# Altium schematic sheet STLink_V3E_Module.SchDoc: STLINK V3E Module
size A4; Project: STM32H7-DK; Date: Not used; ApprovedBy: Not used; CheckedBy: Not used; Author: Not used; CompanyName: STMicroelectronics; DrawnBy: Not used; Engineer: Not used; Organization: Not used; Address1: Not used; Address2: Not used; Address3: Not used; Address4: Not used; DocumentNumber: Not used; Revision: Not used; SheetNumber: 12; SheetTotal: 16; CurrentTime: Not used; CurrentDate: Not used; Time: Not used; DocumentFullPathAndName: Not used; DocumentName: Not used; ModifiedDate: Not used; ImagePath: Not used; ProjectName: Not used; Application_BuildNumber: Not used
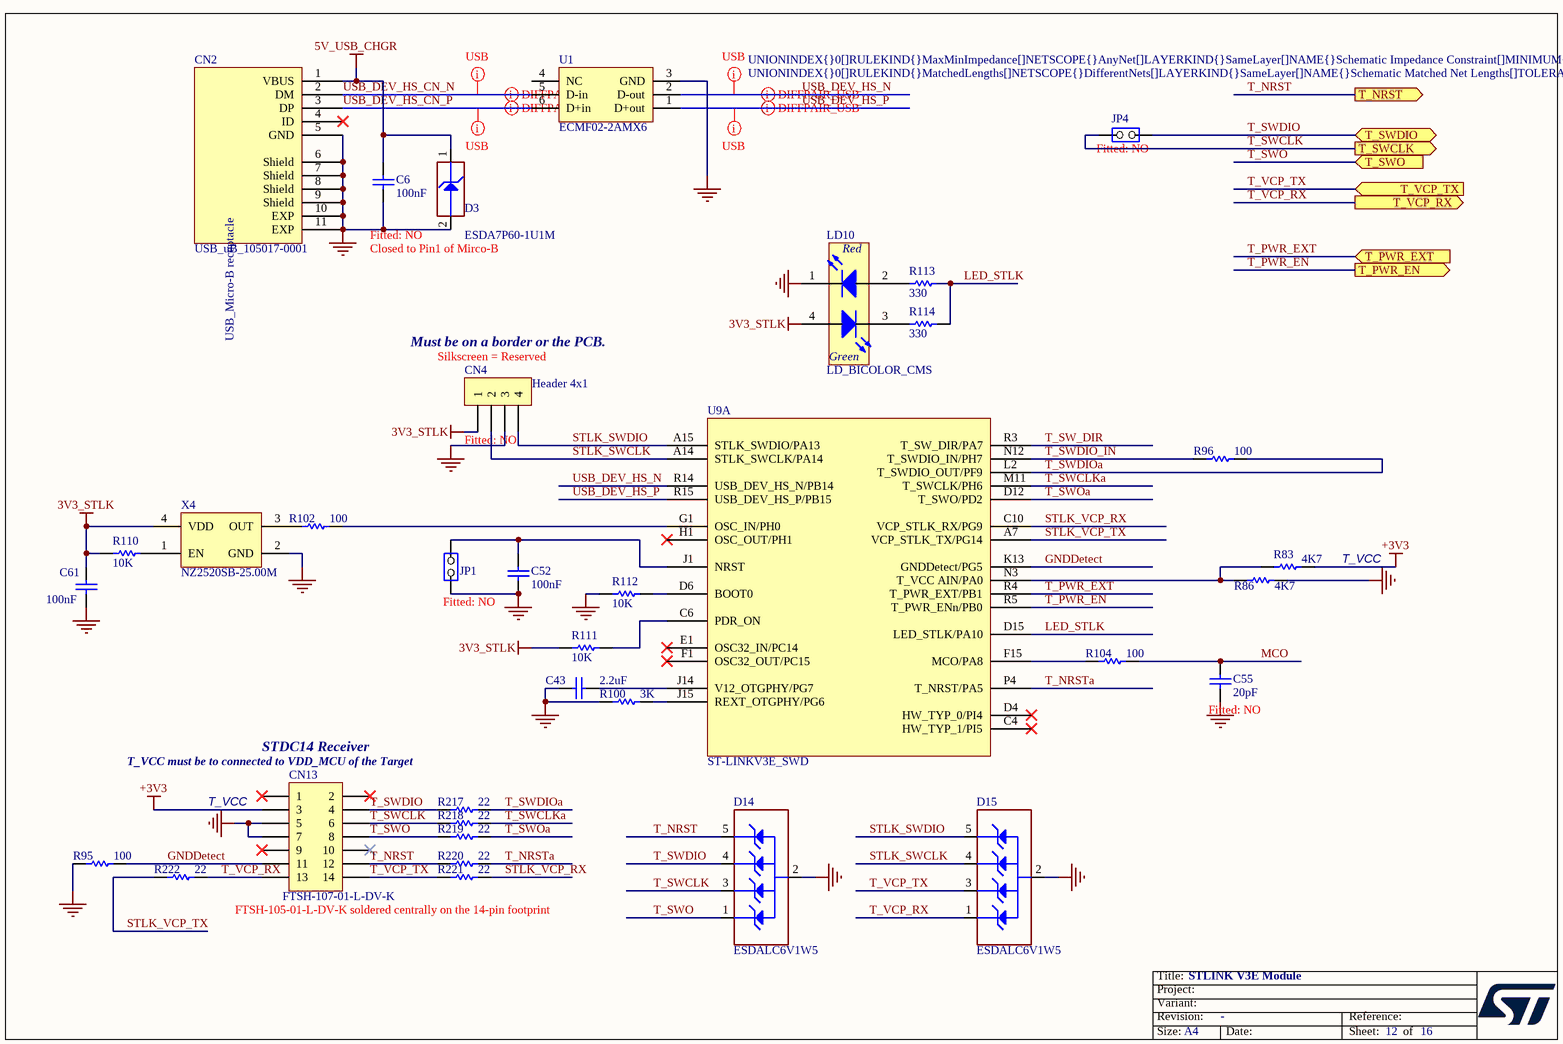
[diagram p0: STLink_V3E_Module.SchDoc]

## Parts
C6  value 100nF  Fitted: NO  [0402C]  (hidden comment: [N/A])
C43  2.2uF  [0603C]
C52  100nF  [0402C]
C55  value 20pF  Fitted: NO  [0402C]  (hidden comment: [N/A])
C61  100nF  [0402C]
CN2  value USB_uB_105017-0001  [MICRO_USB_B_105017]  (hidden comment: USB_uB_105017.0001)
CN4  Fitted: NO  [HDR_1X4_2R54]  (hidden comment: Header 4x1)
CN13  FTSH-107-01-L-DV-K  [FTSH-107-01-L-DV_B]
D3  ESDA7P60-1U1M  [DO_2SM_1R6X1_21]
D14  ESDALC6V1W5  [SC70-5]
D15  ESDALC6V1W5  [SC70-5]
JP1  Fitted: NO  [SIP2]  (hidden comment: Jumper Header 2x1)
JP4  Fitted: NO  [SIP2]  (hidden comment: Jumper Header 2x1)
LD10  LD_BICOLOR_CMS  [LED2_3528]
R83  4K7  [0402R]
R86  4K7  [0402R]
R95  100  [0402R]
R96  100  [0402R]
R100  3K  [0402R]
R102  100  [0402R]
R104  100  [0402R]
R110  10K  [0402R]
R111  10K  [0402R]
R112  10K  [0402R]
R113  330  [0603R]
R114  330  [0603R]
R217  22  [0603R]
R218  22  [0603R]
R219  22  [0603R]
R220  22  [0603R]
R221  22  [0603R]
R222  22  [0603R]
U1  ECMF02-2AMX6  [DFN6_0R5_1R7X1R5]
U9  ST-LINKV3E_SWD  [BGA176_0R65_10x10]  (part A of 2)
X4  NZ2520SB-25.00M  [OSC_4SM_2R5X2]

## Ports
T_NRST (out), T_PWR_EN (out), T_PWR_EXT (in), T_SWCLK (out), T_SWDIO (bidir), T_SWO (in), T_VCP_RX (out), T_VCP_TX (in)

## Nets
3V3_STLK: C61.2 CN4.1 LD10.4(YellowGreen_anode) R110.1 R111.1 X4.4(VDD)
5V_USB_CHGR: C6.2 CN2.1(VBUS) D3.1(IO1)
+3V3: CN13.3 R83.2
GND: C6.1 C43.1 C52.1 C55.1 C61.1 CN2.5(GND) CN2.6(Shield) CN2.7(Shield) CN2.8(Shield) CN2.9(Shield) CN2.10(EXP) CN2.11(EXP) CN4.3 CN13.5 CN13.7 D3.2(GND) D14.2(GND) D15.2(GND) JP1.1(COMMON) LD10.1(RED_cathode) R86.2 R95.1 R100.1 R112.1 U1.3(GND) X4.2(GND)
GNDDetect: CN13.11 R95.2 U9.K13(GNDDetect/PG5)
LED_STLK: R113.2 R114.2 U9.D15(LED_STLK/PA10)
MCO: C55.2 R104.2
STLK_SWCLK: CN4.2 D15.4(IO3) U9.A14(STLK_SWCLK/PA14)
STLK_SWDIO: CN4.4 D15.5(IO4) U9.A15(STLK_SWDIO/PA13)
STLK_VCP_RX: R221.1 U9.C10(VCP_STLK_RX/PG9)
STLK_VCP_TX: R222.2 U9.A7(VCP_STLK_TX/PG14)
T_NRST: CN13.12 D14.5(IO4) R220.2 ; port T_NRST
T_NRSTa: R220.1 U9.P4(T_NRST/PA5)
T_PWR_EN: U9.R5(T_PWR_ENn/PB0) ; port T_PWR_EN
T_PWR_EXT: U9.R4(T_PWR_EXT/PB1) ; port T_PWR_EXT
T_SW_DIR: U9.R3(T_SW_DIR/PA7)
T_SWCLK: CN13.6 D14.3(IO2) JP4.1(COMMON) R218.2 ; port T_SWCLK
T_SWCLKa: R218.1 U9.M11(T_SWCLK/PH6)
T_SWDIO: CN13.4 D14.4(IO3) JP4.2(NO) R217.2 ; port T_SWDIO
T_SWDIO_IN: R96.1 U9.N12(T_SWDIO_IN/PH7)
T_SWDIOa: R96.2 R217.1 U9.L2(T_SWDIO_OUT/PF9)
T_SWO: CN13.8 D14.1(IO1) R219.2 ; port T_SWO
T_SWOa: R219.1 U9.D12(T_SWO/PD2)
T_VCP_RX: CN13.13 D15.1(IO1) R222.1 ; port T_VCP_RX
T_VCP_TX: CN13.14 D15.3(IO2) R221.2 ; port T_VCP_TX
USB_DEV_HS_CN_N: CN2.2(DM) U1.5(D-in)
USB_DEV_HS_CN_P: CN2.3(DP) U1.6(D+in)
USB_DEV_HS_N: U1.2(D-out) U9.R14(USB_DEV_HS_N/PB14)
USB_DEV_HS_P: U1.1(D+out) U9.R15(USB_DEV_HS_P/PB15)
NetC43_2: C43.2 U9.J14(V12_OTGPHY/PG7)
NetC52_2: C52.2 JP1.2(NO) U9.J1(NRST)
NetLD10_2: LD10.2(Red_anode) R113.1
NetLD10_3: LD10.3(YellowGreen_cathode) R114.1
NetR83_1: R83.1 R86.1 U9.N3(T_VCC_AIN/PA0)
NetR100_2: R100.2 U9.J15(REXT_OTGPHY/PG6)
NetR102_1: R102.1 X4.3(OUT)
NetR102_2: R102.2 U9.G1(OSC_IN/PH0)
NetR104_1: R104.1 U9.F15(MCO/PA8)
NetR110_2: R110.2 X4.1(EN)
NetR111_2: R111.2 U9.C6(PDR_ON)
NetR112_2: R112.2 U9.D6(BOOT0)

Not connected (* = marked no-connect by the designer): CN2 4(ID)*; CN13 1* 2* 9* 10*; U1 4(NC); U9 C4(HW_TYP_1/PI5)* D4(HW_TYP_0/PI4)* E1(OSC32_IN/PC14)* F1(OSC32_OUT/PC15)* H1(OSC_OUT/PH1)*

## Layout directives
differential pair; rule Impedance Constraint [Min = 85.00    Max = 95.00    ]: USB_DEV_HS_CN_N, USB_DEV_HS_CN_P, USB_DEV_HS_N, USB_DEV_HS_P
rule Undefined; rule Matched Net Lengths [Tolerance = 0.2mm]; rule Impedance Constraint [Min = 85.00    Max = 95.00    ]: USB_DEV_HS_CN_N, USB_DEV_HS_CN_P, USB_DEV_HS_N, USB_DEV_HS_P

## Notes on the sheet
- (near D3) Closed to Pin1 of Mirco-B
- Must be on a border or the PCB.
- (near CN4) Silkscreen = Reserved
- (near R83) T_VCC
- T_VCC must be to connected to VDD_MCU of the Target
- (near CN13) STDC14 Receiver
- T_VCC
- FTSH-105-01-L-DV-K soldered centrally on the 14-pin footprint
- Title:
- Project:
- Size:
- Revision:
- Variant:
- A4
- -
- Date:
- Reference:
- Sheet:
- of
- (in symbol MCD-00028) USB_Micro-B receptacle
- (in symbol MCD-00051) Red; Green

## Library data of the parts
C6 C55 = MCD-00016: Capacitor,20pF,50V,NPO,5%,0402; Manufacturer_Part_Number: CC0402JRNPO9BN200; Manufacturer: YAGEO; Provided_By: Subcon; Initial_Board_Reference: mb1274; Internal_Part_Number: MCD-00016; Status: Released; Package: 0402; ComponentLink1Description: Yageo_Capacitor_NP0_16V-to-50V.pdf; ECCN_US: n/a; ECCN_EU: n/a; Part_Type: Capacitor
C43 = MCD-00012: Capacitor,2.2uF,10V, X5R,10%,0603; Manufacturer_Part_Number: CC0603KRX5R6BB225; Manufacturer: YAGEO; Alternate_Manufacturer_Part_Number: C0603C225K8PACTU; Alternate_Manufacturer: KEMET; Provided_By: Subcon; Initial_Board_Reference: mb1274; Internal_Part_Number: MCD-00012; Value: 2.2uF; Status: Released; Package: 0603; ComponentLink1Description: Yageo_Capacitor_X5R-series.pdf; ECCN_US: n/a; ECCN_EU: n/a; Part_Type: Capacitor
C52 C61 = MCD-00102: Capacitor,100nF,16V,X7R,10%,0402; Manufacturer_Part_Number: CC0402KRX7R7BB104; Manufacturer: YAGEO; Provided_By: Subcon; Initial_Board_Reference: mb1262; Internal_Part_Number: MCD-00102; Value: 100nF; Status: Released; Package: 0402; ComponentLink1Description: Capacitor_X7R_100pF_to_22uF.pdf; ECCN_US: n/a; ECCN_EU: n/a; Part_Type: Capacitor
CN2 = MCD-00028: USB-MICRO-B, 0.65mm, RA, SMT, Bottom Mount,; Manufacturer_Part_Number: 1050170001; Manufacturer: MOLEX; Part_Type: Connector; Provided_By: Subcon; Initial_Board_Reference: mb1274; Internal_Part_Number: MCD-00028; Status: Released; ComponentLink1Description: Molex_Connector-USB-uB_1050170001.pdf; ECCN_US: n/a; ECCN_EU: n/a
CN4 = MCD-00029: Header, 4x1, 2,54mm, VR, TH, Height 5.84mm/2.54mm; Manufacturer_Part_Number: TSW-104-07-x-S; Manufacturer: SAMTEC; Part_Type: Connector; Provided_By: Subcon; Initial_Board_Reference: mb1274; Internal_Part_Number: MCD-00029; Value: Header 4x1; Status: Released; ComponentLink1Description: Samtec_Connector_TSW-HTSW-series.pdf; ECCN_US: n/a; ECCN_EU: n/a
CN13 = MCD-00592: Header 7x2, 1.27mm, Dual row, Straight; Manufacturer_Part_Number: FTSH-107-01-L-DV-009-ES-A; Manufacturer: SAMTEC; Part_Type: Connector; Provided_By: Subcon; Initial_Board_Reference: mb1331; Internal_Part_Number: MCD-00592; Value: FTSH-107-01-L-DV-K; Status: Symbol available; ComponentLink1Description: Samtec_ftsh_smt.pdf; ComponentLink1URL: http://tunmcdsvn.tun.st.com/Component_Datasheet_Library/Trunk/Connectors/Samtec_ftsh_smt.pdf
D3 = ESDALC6V1-1U2: Dual Transil array for ESD protection; Manuf_1: STM; Ref St: .; ECCN_US/EU: EAR99/NEC; Fitted: NO; Provided: ST; Manuf_Part_1: ESDA7P60-1U1M; Distrib: ST; Ordered by: STM; Order: ESDA7P60-1U1M
D14 D15 = ESDALC6V1W5: Dual Transil array for ESD protection; Manuf_1: STM; Ref St: 9179034; Fitted: YES; ECCN_US/EU: EAR99/NEC; Manuf_Part_1: ESDALC6V1W5; Distrib: ST; Order: ESDALC6V1W5; Ordered by: STM
JP1 JP4 = MCD-00045: Header, 2x1, 2,54mm, VR, TH, Height 5.84mm/2.54mm; Manufacturer_Part_Number: TSW-102-07-x-S; Manufacturer: SAMTEC; Part_Type: Connector; Value: Jumper_Header_2x1; Provided_By: Subcon; Initial_Board_Reference: mb1274; Internal_Part_Number: MCD-00045; Status: Released; ComponentLink1Description: Samtec_Connector_TSW-HTSW-series.pdf; ECCN_US: n/a; ECCN_EU: n/a
LD10 = MCD-00051: LED Bicolor; Part_Type: Display; Manufacturer_Part_Number: HSMF-A201-A00J1; Manufacturer: AVAGO TECHNOLOGIES; Alternate_Manufacturer_Part_Number: LE-RGW35280; Alternate_Manufacturer: EVERLUCK; ECCN_US: EAR99; ECCN_EU: NEC; Provided_By: Subcon; Initial_Board_Reference: mb1274; Internal_Part_Number: MCD-00051; Value: LD_BICOLOR_CMS; Status: Released; ComponentLink1Description: Avago_LED-SMC_HSMx-A2xx-02Feb2012.pdf
R83 R86 = MCD-00065: Resistor,4K7,0402,1%,1/16W; Manufacturer_Part_Number: RC0402FR-074K7L; Manufacturer: YAGEO; Alternate_Manufacturer_Part_Number: RT0402FRE074K7L; Provided_By: Subcon; Initial_Board_Reference: mb1274; Internal_Part_Number: MCD-00065; Value: 4K7; Status: Released; ComponentLink1Description: Yageo_Resistor_RC0402-series.pdf; ECCN_US: n/a; ECCN_EU: n/a; Alternate_Manufacturer: YAGEO; Part_Type: Resistor
R95 R96 R102 R104 = MCD-00119: Resistor,100R,0402,1%,1/16W; Manufacturer_Part_Number: RC0402FR-07100RL; Manufacturer: YAGEO; Provided_By: Subcon; Initial_Board_Reference: mb1262; Internal_Part_Number: MCD-00119; Value: 100; Status: Released; Part_Type: Resistor; ComponentLink1Description: Yageo_Resistor_RC0402-series.pdf; ECCN_US: n/a; ECCN_EU: n/a
R100 = MCD-00185: Resistor,3K,0402,1%,1/16W; Manufacturer_Part_Number: RC0402FR-073KL; Manufacturer: YAGEO; Provided_By: Subcon; Internal_Part_Number: MCD-00185; Value: 3K; Status: Released; ComponentLink1Description: Yageo_Resistor_RC0402-series.pdf; ECCN_US: n/a; ECCN_EU: n/a; Part_Type: Resistor
R110-R112 = MCD-00053: Resistor,10K,0402,1%,1/16W; Manufacturer_Part_Number: RC0402FR-0710KL; Manufacturer: YAGEO; Provided_By: subcon; Initial_Board_Reference: mb1274; Internal_Part_Number: MCD-00053; Value: 10K; Status: Released; ComponentLink1Description: Yageo_Resistor_RC0402-series.pdf; ECCN_US: n/a; ECCN_EU: n/a; Part_Type: Resistor
R113 R114 = MCD-00197: Resistor,330R,0603,1%,1/10W; Manufacturer_Part_Number: RC0603FR-07330RL; Manufacturer: YAGEO; Provided_By: Subcon; Internal_Part_Number: MCD-00197; Value: 330; Status: Released; ComponentLink1Description: Yageo_Resistor_RC0603-series.pdf; ECCN_US: n/a; ECCN_EU: n/a; Part_Type: Resistor
R217-R222 = Res1: Resistor; Value: 1K; Published: 8-Jun-2000; Revision: July-2002: Re-released for DXP Platform.; Publisher: Altium Limited
U1 = ECMF02-2AMX6: Common mode filter with ESD protection for USB 2.0 interface; Manuf_1: STM; ECCN_US/EU: EAR99/NEC; Fitted: YES; Manuf_Part_1: ECMF02-2AMX6; Ordered by: STM; Value: ECMF02-2AMX6
U9 = ST-LINKV3E_SWD: STM32F723IEK  (STM32F7 LittleBirdie) BGA176; Internal_Part_Number: MCD-00596; Manuf_Part_1: STM32F723IEK6; Manuf_1: STM; Initial_Board_Reference: mb1331; Fitted: YES; ECCN_US/EU: 3A991A2/NEC; Value: ST-LINKV3E_SWD; ComponentLink1Description: BGA176+25L_10x10x0.6_pitch0.65.pdf; ComponentLink1URL: http://tunmcdsvn.tun.st.com/Component_Datasheet_Library/Trunk/IC/BGA176+25L_10x10x0.6_pitch0.65.pdf; Ordered by: STM
X4 = OSC_25M_NZ2520SB: Oscillator 25.00Mhz, -+50PPM, 3.3V, Temp -55 to +125癈; Manuf_Part_1: NZ2520SB 25MHz END4869B; Manuf_1: NDK; Manuf_Part_2: KC2520B25.0000C10E00; Manuf_2: AVX Corp/Kyocera Corp; Ordered by: STM; ECCN_US/EU: EAR99/NEC; Ref St: 9157031; Fitted: YES